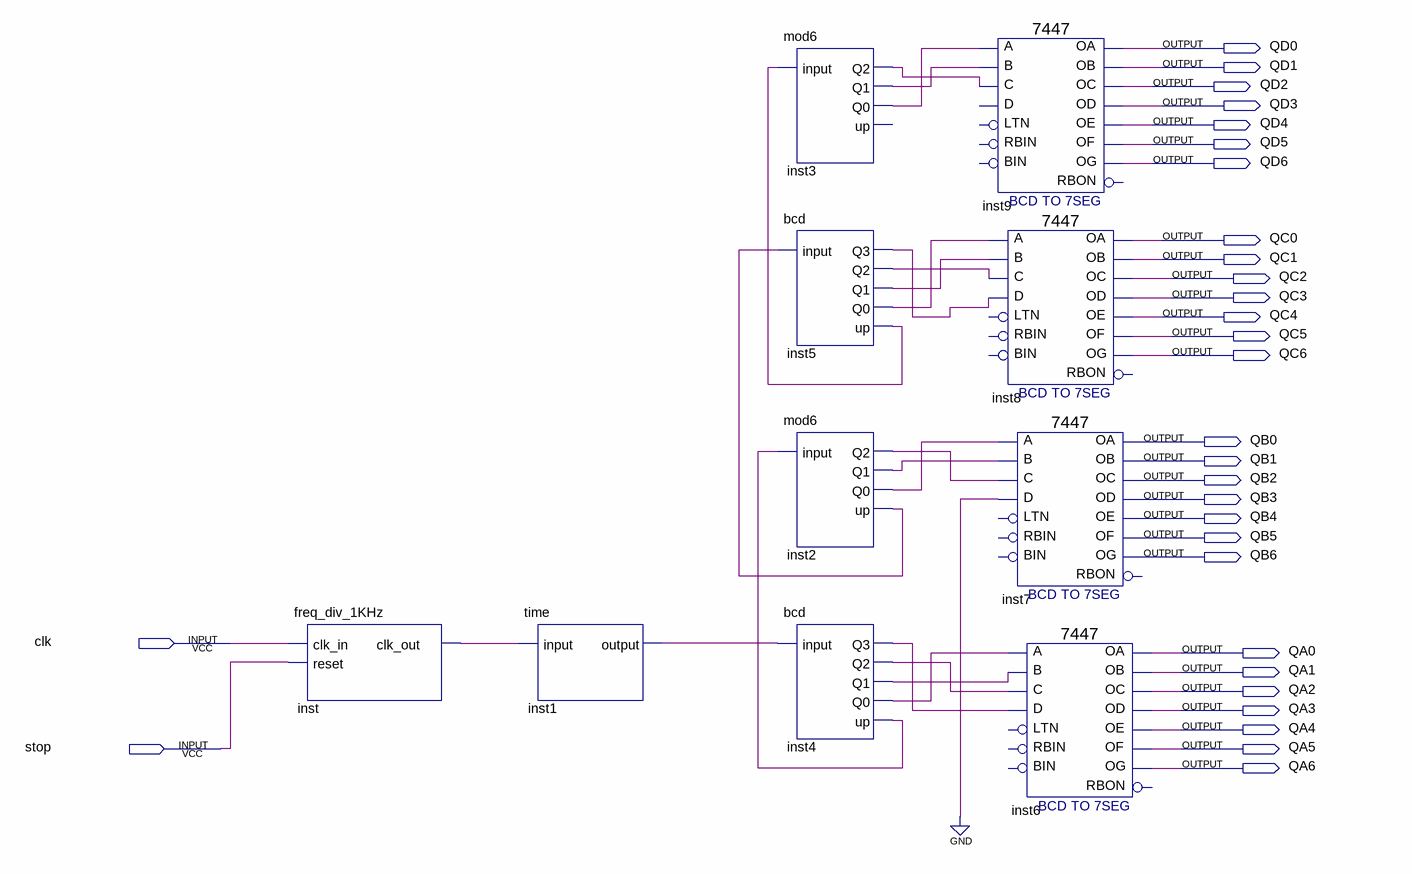
[diagram p0: schematic sheet]
// Quartus schematic lab05.bdf as structural Verilog: 10 symbols, 30 pins
module lab05 (
  input  clk,
  input  stop,
  output QD0,
  output QD1,
  output QD2,
  output QD3,
  output QD4,
  output QD5,
  output QD6,
  output QC0,
  output QC1,
  output QC2,
  output QC3,
  output QC4,
  output QC5,
  output QC6,
  output QB0,
  output QB1,
  output QB2,
  output QB3,
  output QB4,
  output QB5,
  output QB6,
  output QA0,
  output QA1,
  output QA2,
  output QA3,
  output QA4,
  output QA5,
  output QA6
);

  wire inst1_output, inst2_q0, inst2_q1, inst2_q2, inst2_up, inst3_q0, inst3_q1, inst3_q2, inst4_q0,
       inst4_q1, inst4_q2, inst4_q3, inst4_up, inst5_q0, inst5_q1, inst5_q2, inst5_q3, inst5_up, inst_clk_out;

  freq_div_1KHz inst (.clk_in(clk), .reset(stop), .clk_out(inst_clk_out));
  \time  inst1 (.\input (inst_clk_out), .\output (inst1_output));
  mod6 inst3 (.\input (inst5_up), .Q2(inst3_q2), .Q1(inst3_q1), .Q0(inst3_q0));  // open: up
  bcd inst5 (.\input (inst2_up), .Q3(inst5_q3), .Q2(inst5_q2), .Q1(inst5_q1), .Q0(inst5_q0), .up(inst5_up));
  mod6 inst2 (.\input (inst4_up), .Q2(inst2_q2), .Q1(inst2_q1), .Q0(inst2_q0), .up(inst2_up));
  bcd inst4 (.\input (inst1_output), .Q3(inst4_q3), .Q2(inst4_q2), .Q1(inst4_q1), .Q0(inst4_q0), .up(inst4_up));
  \7447  inst9 (
    .B(inst3_q1), .C(inst3_q2), .A(inst3_q0), .OB(QD1), .OC(QD2), .OE(QD4), .OD(QD3), .OF(QD5), .OG(QD6),
    .OA(QD0));  // open: LTN, D, RBIN, BIN, RBON
  \7447  inst8 (
    .B(inst5_q1), .C(inst5_q2), .D(inst5_q3), .A(inst5_q0), .OB(QC1), .OC(QC2), .OE(QC4), .OD(QC3), .OF(QC5),
    .OG(QC6), .OA(QC0));  // open: LTN, RBIN, BIN, RBON
  \7447  inst7 (
    .B(inst2_q1), .C(inst2_q2), .D(1'b0), .A(inst2_q0), .OB(QB1), .OC(QB2), .OE(QB4), .OD(QB3), .OF(QB5),
    .OG(QB6), .OA(QB0));  // open: LTN, RBIN, BIN, RBON
  \7447  inst6 (
    .B(inst4_q1), .C(inst4_q2), .D(inst4_q3), .A(inst4_q0), .OB(QA1), .OC(QA2), .OE(QA4), .OD(QA3), .OF(QA5),
    .OG(QA6), .OA(QA0));  // open: LTN, RBIN, BIN, RBON
endmodule
